# EAGLE schematic jtag-adapter-1-2 (EAGLE 8.4.3)
AUTHOR: Balazs Racz; DRAWING_TITLE: SWD adaptor board; REVISION: A; YEAR: 2018
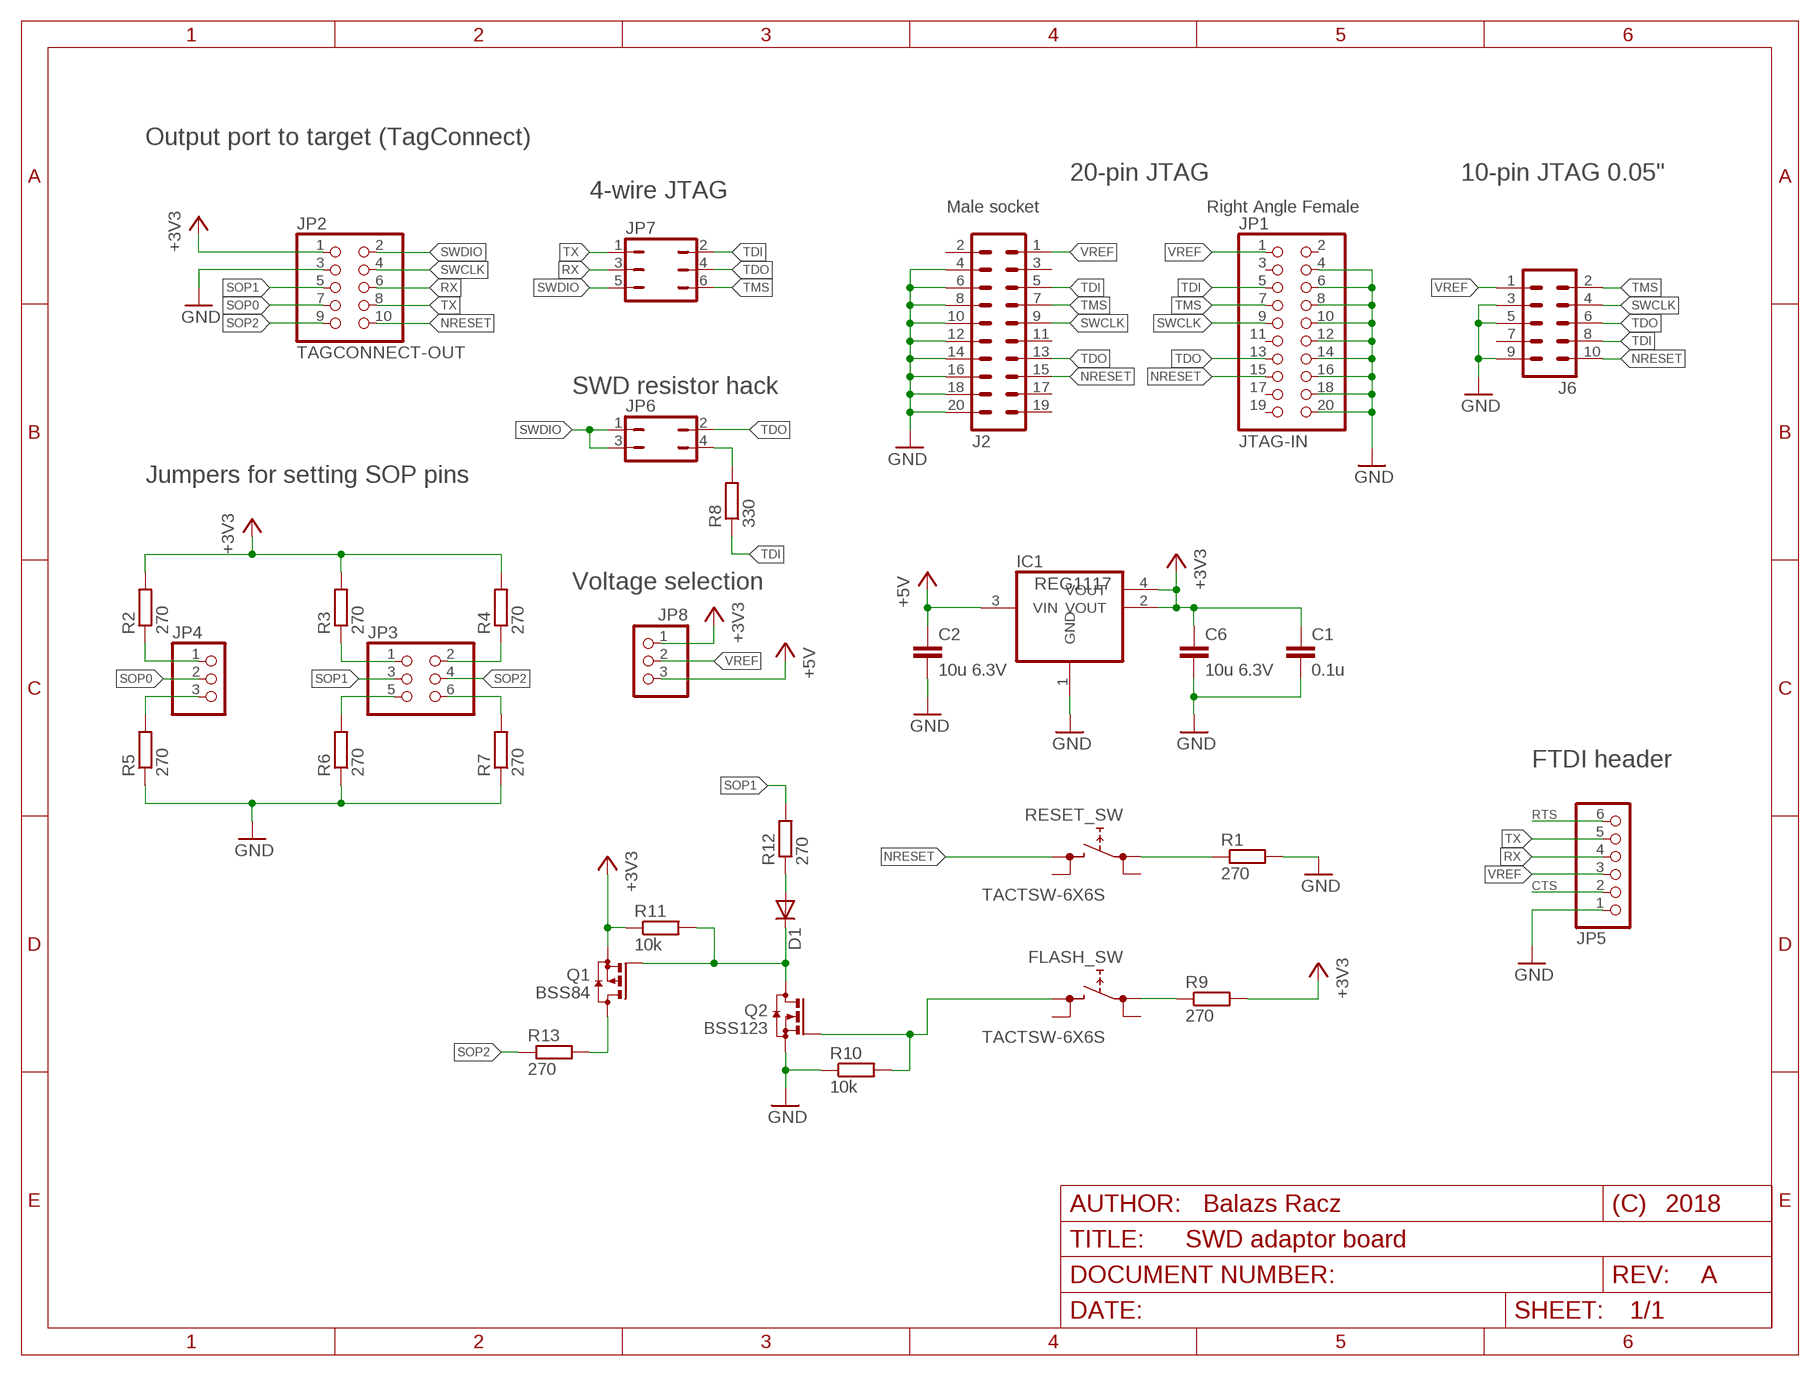
[diagram p0: schematic, sheet 1]

## Parts
C1  0.1u  C-EUC0603K  [C0603K]
C2  10u 6.3V  C-EUC0603K  [C0603K]
C6  10u 6.3V  C-EUC0603K  [C0603K]
D1  DIODE-MINIMELF  [MINIMELF]
FLASH_SW  TACTSW-6X6S  [TACTSW-6X6]
IC1  REG1117  [SOT223]
J2  MA10-2S  [MA10-2-SHROUDED]
J6  MA05-2_0.05X0.05  [MA05-2_0.05_X_0.05]
JP1  JTAG-IN  PINHD-2X10/90  [2X10/90]
JP2  TAGCONNECT-OUT  PINHD-2X5CN  [CON10M]
JP3  PINHD-2X3  [2X03]
JP4  PINHD-1X3  [1X03]
JP5  PINHD-1X6  [1X06]
JP6  JP2Q  [JP2Q]
JP7  JP3Q  [JP3Q]
JP8  PINHD-1X3  [1X03]
Q1  BSS84  [SOT23]
Q2  BSS123  [SOT23]
R1  270  R-EU_R0805  [R0805]
R2  270  R-EU_R0805  [R0805]
R3  270  R-EU_R0805  [R0805]
R4  270  R-EU_R0805  [R0805]
R5  270  R-EU_R0805  [R0805]
R6  270  R-EU_R0805  [R0805]
R7  270  R-EU_R0805  [R0805]
R8  330  R-EU_R0805  [R0805]
R9  270  R-EU_R0805  [R0805]
R10  10k  R-EU_R0805  [R0805]
R11  10k  R-EU_R0805  [R0805]
R12  270  R-EU_R0805  [R0805]
R13  270  R-EU_R0805  [R0805]
RESET_SW  TACTSW-6X6S  [TACTSW-6X6]

## Nets
+3V3: C1.1 C6.1 IC1.2(VOUT) IC1.4(VOUT) JP2.1 JP8.1 Q1.2(S) R2.2 R3.2 R4.2 R9.2 R11.1
+5V: C2.1 IC1.3(VIN) JP8.3
CTS: JP5.2
GND: C1.2 C2.2 C6.2 IC1.1(GND) J2.4 J2.6 J2.8 J2.10 J2.12 J2.14 J2.16 J2.18 J2.20 J6.3 J6.5 J6.9 JP1.4 JP1.6 JP1.8 JP1.10 JP1.12 JP1.14 JP1.16 JP1.18 JP1.20 JP2.3 JP5.1 Q2.2(S) R1.2 R5.1 R6.1 R7.1 R10.1
N$1: R1.1 RESET_SW.1(1.1)
N$2: JP4.1 R2.1
N$3: JP4.3 R5.2
N$4: JP6.4 R8.2
N$5: JP3.1 R3.1
N$6: JP3.2 R4.1
N$7: JP3.6 R7.2
N$8: JP3.5 R6.2
N$9: D1.C Q1.1(G) Q2.3(D) R11.2
N$10: FLASH_SW.1(1.1) R9.1
N$11: FLASH_SW.3(2.1) Q2.1(G) R10.2
N$12: D1.A R12.1
N$13: Q1.3(D) R13.2
NRESET: J2.15 J6.10 JP1.15 JP2.10 RESET_SW.3(2.1)
RTS: JP5.6
RX: JP2.6 JP5.4 JP7.3
SOP0: JP2.7 JP4.2
SOP1: JP2.5 JP3.3 R12.2
SOP2: JP2.9 JP3.4 R13.1
SWCLK: J2.9 J6.4 JP1.9 JP2.4
SWDIO: JP2.2 JP6.1 JP6.3 JP7.5
TDI: J2.5 J6.8 JP1.5 JP7.2 R8.1
TDO: J2.13 J6.6 JP1.13 JP6.2 JP7.4
TMS: J2.7 J6.2 JP1.7 JP7.6
TX: JP2.8 JP5.5 JP7.1
VREF: J2.1 J6.1 JP1.1 JP5.3 JP8.2
Unconnected: FLASH_SW.2(1.2) FLASH_SW.4(2.2) J2.2 J2.3 J2.11 J2.17 J2.19 J6.7 JP1.2 JP1.3 JP1.11 JP1.17 JP1.19 RESET_SW.2(1.2) RESET_SW.4(2.2)

## Notes on the sheet
- Output port to target (TagConnect)
- 20-pin JTAG | 10-pin JTAG 0.05"
- 4-wire JTAG
- Male socket | Right Angle Female
- SWD resistor hack
- Jumpers for setting SOP pins
- Voltage selection
- FTDI header

## Library data of the parts
C1 C2 C6 = resistor:C-EU: CAPACITOR, European symbol
D1 = diode:DIODE-: DIODE
FLASH_SW RESET_SW = trainlib:TACTSW-6X6: 6.2 X 6.5mm TACT Switch (SMD) Source: http://www3.alps.co.jp/WebObjects/catalog.woa/PDF/E/Switch/Tact/SKHM/SKHM.PDF
IC1 = trainlib:REG1117: 800mA and 1A Low Dropout (LDO) Positive Regulator 1.8V, 2.5V, 2.85V, 3.3V, 5V, and Adj; MPN: REG1117; OC_FARNELL: 1097566; OC_NEWARK: 14P6981
J2 = tcs:MA10-2: PIN HEADER
J6 = tcs:MA05-2: PIN HEADER
JP1 = pinhead:PINHD-2X10: PIN HEADER
JP2 = trainlib:PINHD-2X5: PIN HEADER
JP3 = pinhead:PINHD-2X3: PIN HEADER
JP4 JP8 = adafruit:PINHD-1X3: PIN HEADER
JP5 = pinhead:PINHD-1X6: PIN HEADER
JP6 = jumper:JP2Q: JUMPER
JP7 = trainlib:JP3Q: JUMPER
Q1 = trainlib:BSS84: P-CHANNEL MOS FET
Q2 = transistor-small-signal:BSS123: N-CHANNEL MOS FET
R1-R13 = rcl:R-EU_: RESISTOR, European symbol

## Net classes
1 pwr: width 0.254 mm